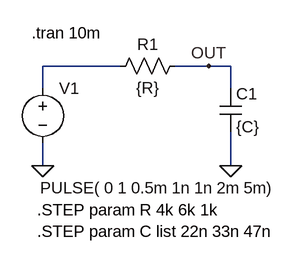
[diagram p0: schematic Fig_4-29_STEP-regend.asc]
Fig_4-29_STEP-regend.asc, the LTspice schematic file:
Version 4
SHEET 1 880 680
WIRE 144 80 32 80
WIRE 272 80 224 80
WIRE 304 80 272 80
WIRE 32 112 32 80
WIRE 304 112 304 80
WIRE 32 224 32 192
WIRE 304 224 304 176
FLAG 32 224 0
FLAG 272 80 OUT
FLAG 304 224 0
SYMBOL voltage 32 96 R0
WINDOW 3 -4 160 Left 2
SYMATTR InstName V1
SYMATTR Value PULSE( 0 1 0.5m 1n 1n 2m 5m)
SYMBOL res 128 96 R270
WINDOW 0 32 56 VTop 2
WINDOW 3 0 56 VBottom 2
SYMATTR InstName R1
SYMATTR Value {R}
SYMBOL cap 288 112 R0
SYMATTR InstName C1
SYMATTR Value {C}
TEXT 16 32 Left 2 !.tran 10m
TEXT 24 288 Left 2 !.STEP param R 4k 6k 1k\n.STEP param C list 22n 33n 47n

The netlist it stands for:
* Fig_4-29_STEP-regend.asc
V1 N001 0 PULSE( 0 1 0.5m 1n 1n 2m 5m)
R1 N001 OUT {R}
C1 OUT 0 {C}
.tran 10m
.STEP param R 4k 6k 1k
.STEP param C list 22n 33n 47n
.backanno
.end